# EAGLE design Sensorboard (EAGLE 6.1)
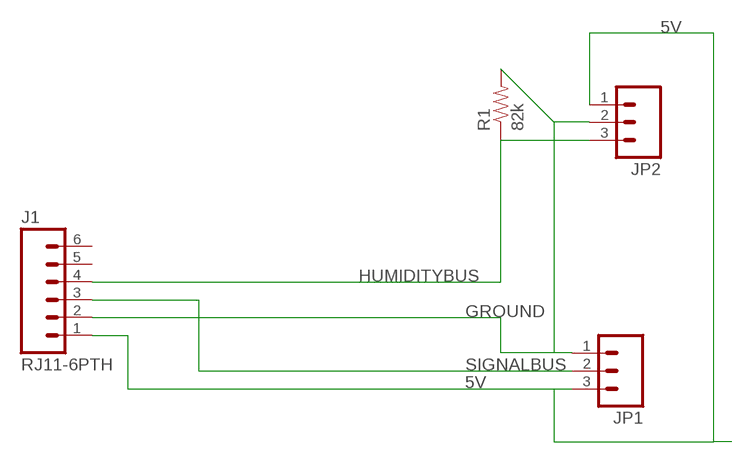
[diagram p0: schematic, sheet 1]

## Parts
J1  RJ11-6PTH  [RJ11-6]
JP1  M03PTH  [1X03]
JP2  M03PTH  [1X03]
R1  82k  RESISTORKIT  [AXIAL-0.3-KIT]

## Nets
5V: J1.1 JP1.3 JP2.1
GROUND: J1.2 JP1.1 JP2.2 R1.P$2
HUMIDITYBUS: J1.4 JP2.3 R1.P$1
SIGNALBUS: J1.3 JP1.2
Unconnected: J1.5 J1.6

## Library data of the parts
J1 = SparkFun:RJ11-6: RJ11 Jack Simple 6 pin RJ11 jack. Commonly found on CAT3 devices and Microchip programmers. SKU: PRT-00132
JP1 JP2 = SparkFun:M03: Header 3 Standard 3-pin 0.1" header. Use with straight break away headers (SKU : PRT-00116), right angle break away headers (PRT-00553), swiss pins (PRT-00743), machine pins (PRT-00117), and female headers (PRT-00115). Molex polarized connector foot print use with SKU : PRT-08232 with associated crimp pins and housings.
R1 = SparkFun:RESISTOR: Resistor Basic schematic elements and footprints for 0603, 1206, and PTH resistors.

## Board
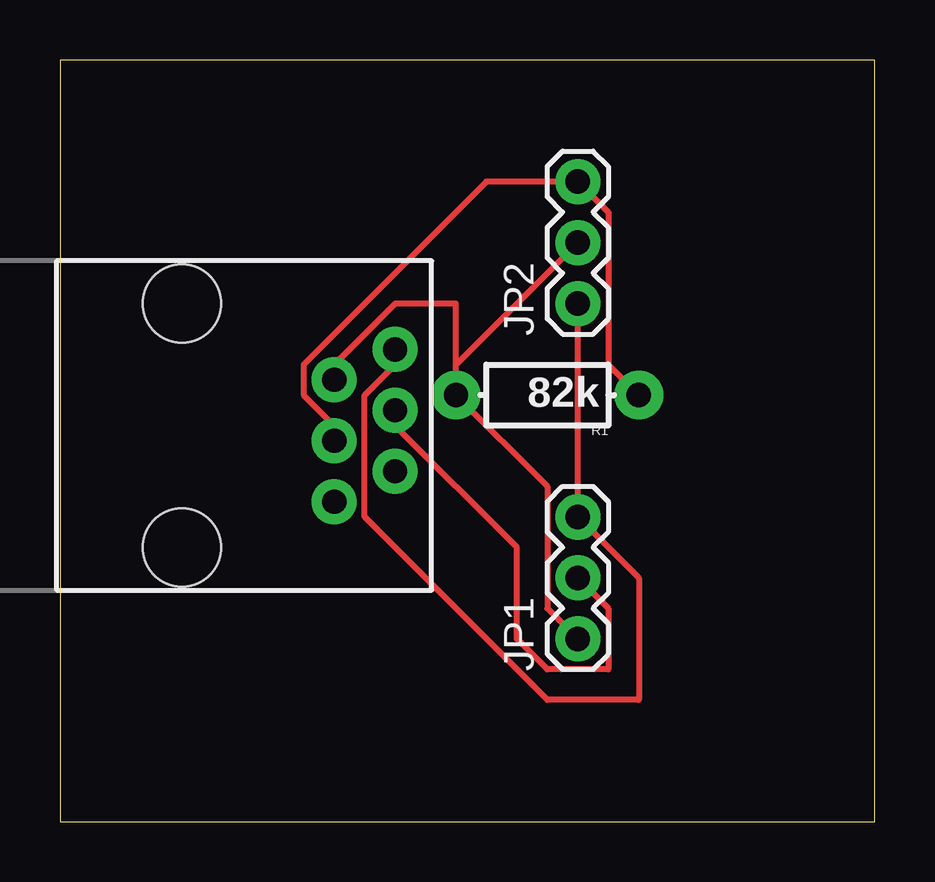
[diagram p1: board, top side]

Size 33.96 x 31.74 mm. Coordinates in mm from the lower left corner, seen from the top.
Outline: 0,0 33.96,0 33.96,31.74 0,31.74 0,0
Copper layers 1: Top 0.035mm
Design rules: minimum track width 10mil, minimum drill 24mil, track to track 8mil, track to pad 8mil, pad to pad 8mil, via to via 8mil, smd to smd 8mil, copper to edge 40mil, drill to drill 8mil, minimum pad ring 10mil, minimum via ring 8mil, stop-mask expansion 4mil, vias tented up to drill 0mil, thermal gap 10mil

### Footprints (pad centres in the part's own frame; a part is rotated, then mirrored left to right if it is on the bottom)
RJ11-6 = drill 1.016 pad 1.88: 1 1.905,8.89; 2 3.175,6.35; 3 4.445,8.89; 4 5.715,6.35; 5 6.985,8.89; 6 8.255,6.35 | hole 3.251: 0,0; 10.16,0
1X03 = drill 1.016 pad 1.88: 1 0,0; 2 2.54,0; 3 5.08,0
AXIAL-0.3-KIT = drill 1.016 pad 2.032: P$1 -3.81,0; P$2 3.81,0

### Placement (x,y rotation side)
J1  5.08,21.59 270 top
JP1  21.59,7.62 90 top
JP2  21.59,21.59 90 top
R1  20.32,17.78 180 top

### Tracks (layer width: path | path; a pad name or v marks a point on that pad's centre or on a via)
5V
  Top 0.254: J1.1 13.97,19.05 12.7,17.78 12.7,12.7 20.32,5.08 24.13,5.08 24.13,10.16 JP1.3 JP2.1
GROUND
  Top 0.254: 16.51,19.05 R1.P$2 20.32,13.97 20.32,8.89 JP1.1 | 16.51,19.05 16.51,21.59 13.97,21.59 11.43,19.05 J1.2 | 16.51,19.05 JP2.2
HUMIDITYBUS
  Top 0.254: J1.4 11.43,16.51 10.16,17.78 10.16,19.05 17.78,26.67 JP2.3 22.86,25.4 22.86,19.05 R1.P$1
SIGNALBUS
  Top 0.254: JP1.2 22.86,8.89 22.86,6.35 20.32,6.35 19.05,7.62 19.05,11.43 13.97,16.51 J1.3